# Altium schematic sheet 02-USB-ps2-blueretro.SchDoc
size A; SheetNumber: 3; SheetTotal: 7
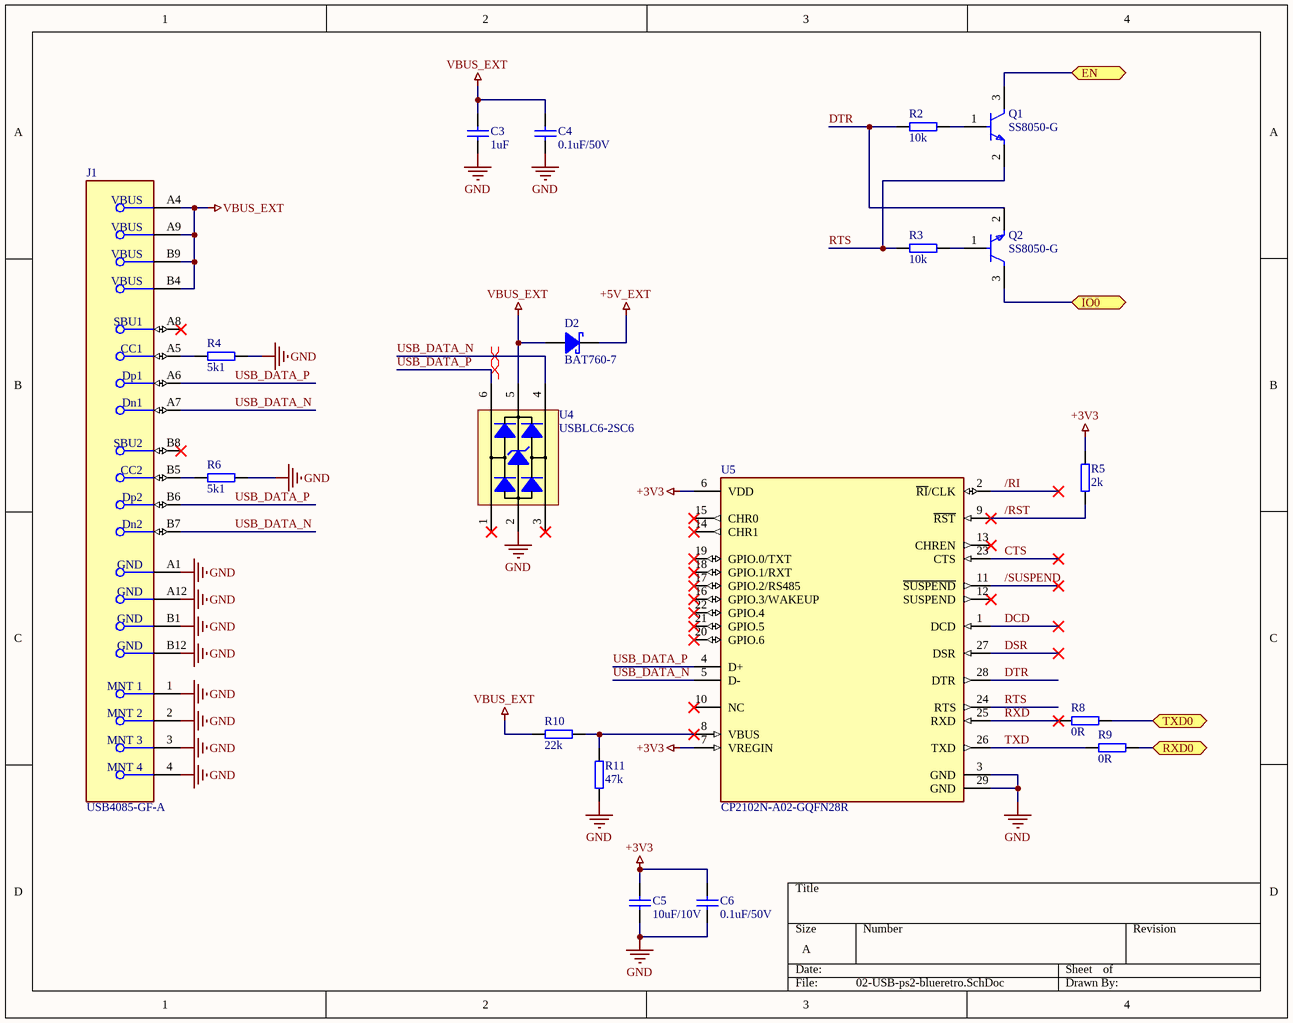
[diagram p0: 02-USB-ps2-blueretro.SchDoc]

## Parts
C3  value 1uF  [cap_0603]  (hidden comment: cap_0603)
C4  value 0.1uF/50V  [cap_0603]  (hidden comment: cap_0603)
C5  value 10uF/10V  [cap_0603]  (hidden comment: cap_0603)
C6  value 0.1uF/50V  [cap_0603]  (hidden comment: cap_0603)
D2  BAT760-7  [sod-323]
J1  USB4085-GF-A  [FP-USB4085-GF-A-MFG]
Q1  SS8050-G  [FP-SS8050-G-MFG]
Q2  SS8050-G  [FP-SS8050-G-MFG]
R2  value 10k  [res_0603]  (hidden comment: res_0603)
R3  value 10k  [res_0603]  (hidden comment: res_0603)
R4  value 5k1  [res_0603]  (hidden comment: res_0603)
R5  value 2k  [res_0603]  (hidden comment: res_0603)
R6  value 5k1  [res_0603]  (hidden comment: res_0603)
R8  value 0R  [res_0603]  (hidden comment: res_0603)
R9  value 0R  [res_0603]  (hidden comment: res_0603)
R10  value 22k  [res_0603]  (hidden comment: res_0603)
R11  value 47k  [res_0603]  (hidden comment: res_0603)
U4  USBLC6-2SC6  [sot23-6l]
U5  CP2102N-A02-GQFN28R  [FP-CP2102N-A02-GQFN28R-MFG]

## Ports
EN (bidir, see 00-ps2-blueretro[3C], 01-ESP32-ps2-blueretro[3B]), IO0 (bidir, see 00-ps2-blueretro[3C], 01-ESP32-ps2-blueretro[1A]), RXD0 (bidir, see 00-ps2-blueretro[3B], 01-ESP32-ps2-blueretro[2B]), TXD0 (bidir, see 00-ps2-blueretro[3C], 01-ESP32-ps2-blueretro[2B])

## Nets
+3V3: C5.2 C6.2 R5.1 U5.6(VDD) U5.7(VREGIN)
+5V_EXT: D2.1(K)
GND: C3.1 C4.1 C5.1 C6.1 J1.1(MNT_1) J1.2(MNT_2) J1.3(MNT_3) J1.4(MNT_4) J1.A1(GND) J1.A12(GND) J1.B1(GND) J1.B12(GND) R4.1 R6.1 R11.2 U4.2 U5.3(GND) U5.29(GND)
VBUS_EXT: C3.2 C4.2 D2.2(A) J1.A4(VBUS) J1.A9(VBUS) J1.B4(VBUS) J1.B9(VBUS) R10.2 U4.5
/RI: U5.2(~{RI}/CLK)
/RST: R5.2 U5.9(~{RST})
/SUSPEND: U5.11(~{SUSPEND})
CTS: U5.23(CTS)
DCD: U5.1(DCD)
DSR: U5.27(DSR)
DTR: Q2.2(E) R2.1 U5.28(DTR)
EN: Q1.3(C) ; port EN
IO0: Q2.3(C) ; port IO0
RTS: Q1.2(E) R3.1 U5.24(RTS)
RXD: R8.2 U5.25(RXD)
RXD0: R9.1 ; port RXD0
TXD: R9.2 U5.26(TXD)
TXD0: R8.1 ; port TXD0
USB_DATA_N: J1.A7(Dn1) J1.B7(Dn2) U4.4 U5.5(D-)
USB_DATA_P: J1.A6(Dp1) J1.B6(Dp2) U4.6 U5.4(D+)
NetJ1_A5: J1.A5(CC1) R4.2
NetJ1_B5: J1.B5(CC2) R6.2
NetQ1_1: Q1.1(B) R2.2
NetQ2_1: Q2.1(B) R3.2
NetR10_1: R10.1 R11.1 U5.8(VBUS)

Not connected (* = marked no-connect by the designer): J1 A8(SBU1)* B8(SBU2)*; U4 1* 3*; U5 10(NC)* 12(SUSPEND)* 13(CHREN)* 14(CHR1)* 15(CHR0)* 16(GPIO.3/WAKEUP)* 17(GPIO.2/RS485)* 18(GPIO.1/RXT)* 19(GPIO.0/TXT)* 20(GPIO.6)* 21(GPIO.5)* 22(GPIO.4)*

## Layout directives
differential pair: USB_DATA_N, USB_DATA_P

## Library data of the parts
D2 = BAT760-7: 30V 1A, Vf=495mV @ 1A, Ir=50µA @ 15V Schottky Diode; Manufacturer: Diodes Incorporated; Supplier: Digikey; Price: 0,48; Manufacturer Part Number: BAT760-7; Supplier Part Number: BAT760DICT-ND; ComponentLink1Description: Supplier Link; ComponentLink1URL: https://www.digikey.at/de/products/detail/diodes-incorporated/BAT760-7/697106; ComponentLink2Description: Manufacturer Link; ComponentLink2URL: *; ComponentLink3Description: Datasheet Link; ComponentLink3URL: https://www.diodes.com/assets/Datasheets/BAT760.pdf
J1 = CMP-196119-000001-2: CONN RCPT USB2.0 TYPE C 24POS RA; Gender: Receptacle; Number of Positions: 16; USB Standard: USB 2.0; Orientation: Right Angle; Contact Plating: Gold; Contact Material: Copper Alloy
Q1 Q2 = CMP-20235-000001-1: NPN TRANSISTOR 1.5A 40V SOT-23 R; Transition Frequency: 100MHz; Max Breakdown Voltage: 25V; Collector Emitter Voltage (VCEO): 400mV; Max Power Dissipation: 300mW; Max Collector Current: 1.5A; Case/Package: TO-236-3; Packaging: Tape and Reel; RoHS Compliant: Yes; Mount: Surface Mount; Collector Emitter Breakdown Voltage: 25V
U4 = USBLC6-2SC6: 2.5V 5A, Vf=1.1V @ 10mA, Ir=6µA @ 2.5V ESD Protection Diode; Manufacturer: STMicroelectronics; Supplier: Digikey; Price: 0,32; Manufacturer Part Number: USBLC6-2SC6; Supplier Part Number: 497-5235-1-ND; ComponentLink1Description: Supplier Link; ComponentLink1URL: https://www.digikey.at/de/products/detail/stmicroelectronics/USBLC6-2SC6/1040559; ComponentLink2Description: Manufacturer Link; ComponentLink2URL: *; ComponentLink3Description: Datasheet Link; ComponentLink3URL: https://www.st.com/content/ccc/resource/technical/document/datasheet/06/1d/48/9c/6c/20/4a/b2/CD00050750.pdf/files/CD00050750.pdf/jcr:content/translations/en.CD00050750.pdf
U5 = CMP-08093-000007-1: IC USB TO UART BRIDGE QFN28